# EAGLE design gesture_control_robot_tx (EAGLE 6.1)
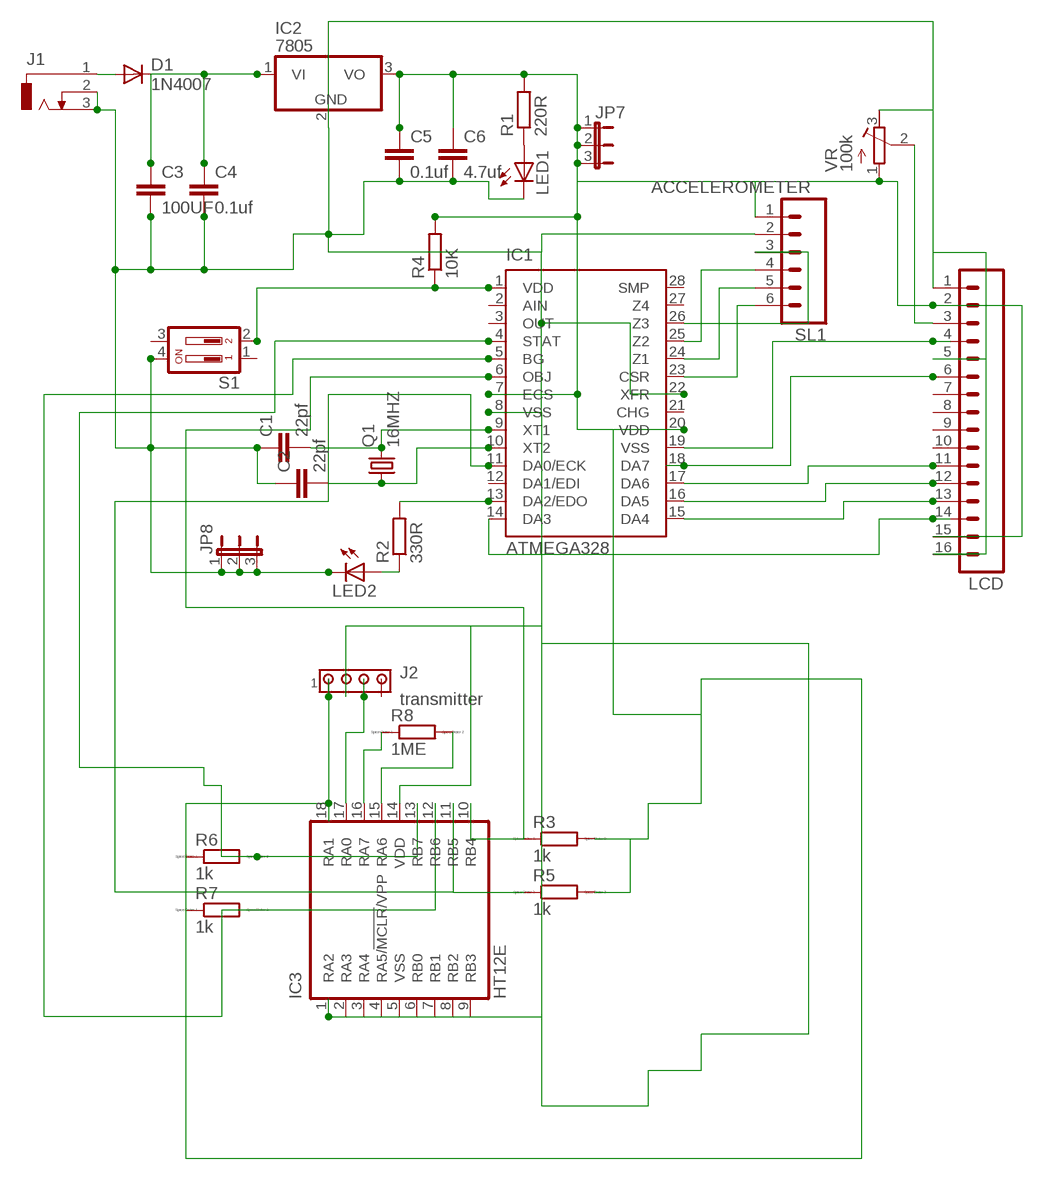
[diagram p0: schematic, sheet 1]

## Parts
C1  22pf  C2.5/2  [C2.5-2]
C2  22pf  C2.5/2  [C2.5-2]
C3  100UF  C2.5/2  [C2.5-2]
C4  0.1uf  C2.5/2  [C2.5-2]
C5  0.1uf  C2.5/2  [C2.5-2]
C6  4.7uf  C2.5/2  [C2.5-2]
D1  1N4007  1N4004  [DO41-10]
IC1  ATMEGA328  QT9701BD  [DIL28-3]
IC2  7805  786TV  [TO220V]
IC3  HT12E  PIC16F1826/27P  [DIL18]
J1  DCJ0303  [DCJ0303]
J2  transmitter  MTA04-100  [10X04MTA]
JP7  JP2E  [JP2]
JP8  JP2E  [JP2]
LCD  M16  [16P]
LED1  LED3MM  [LED3MM]
LED2  LED3MM  [LED3MM]
Q1  16MHZ  CRYSTALHC49S  [HC49/S]
R1  220R  R-EU_0207/10  [0207/10]
R2  330R  R-EU_0207/10  [0207/10]
R3  1k  R0204/7  [0204/7]
R4  10K  R-EU_0207/10  [0207/10]
R5  1k  R0204/7  [0204/7]
R6  1k  R0204/7  [0204/7]
R7  1k  R0204/7  [0204/7]
R8  1ME  R0204/7  [0204/7]
S1  DP02  [DP-02]
SL1  ACCELEROMETER  M06  [06P]
VR  100k  R-TRIMM64P  [RTRIM64P]

## Nets
N$1: C1.2 IC1.9(XT1) Q1.2
N$2: C2.2 IC1.10(XT2) Q1.1
N$3: D1.A J1.1
N$4: C5.1 C6.1 IC1.7(ECS) IC1.20(VDD) IC2.3(VO) IC3.18(RA1) J2.1 JP7.1 JP7.2 JP7.3 LCD.2 LCD.15 R1.2 R3.2 R4.2 R5.2 R6.1 R7.1 SL1.1 VR.1(E)
N$5: C1.1 C2.1 C3.2 C4.2 C5.2 C6.2 IC1.8(VSS) IC1.22(XFR) IC2.2(GND) IC3.1(RA2) IC3.2(RA3) IC3.3(RA4) IC3.4(RA5/!MCLR!/VPP) IC3.5(VSS) IC3.6(RB0) IC3.7(RB1) IC3.8(RB2) IC3.9(RB3) IC3.14(VDD) J1.2 J1.3 J2.2 JP8.1 JP8.2 JP8.3 LCD.1 LCD.5 LCD.16 LED1.K(C) LED2.K(C) S1.4 SL1.2 VR.3(A)
N$6: LED1.A R1.1
N$7: C3.1 C4.1 D1.C IC2.1(VI)
N$8: IC1.23(CSR) SL1.6
N$9: IC1.24(Z1) SL1.5
N$10: IC1.25(Z2) SL1.4
N$11: IC1.26(Z3) SL1.3
N$21: IC1.13(DA2/EDO) R2.2
N$22: LCD.3 VR.2(S)
N$23: IC1.19(VSS) LCD.4
N$24: IC1.18(DA7) LCD.6
N$25: IC1.17(DA6) LCD.11
N$26: IC1.16(DA5) LCD.12
N$27: IC1.15(DA4) LCD.13
N$29: IC1.14(DA3) LCD.14
N$30: IC1.6(OBJ) IC3.10(RB4) R3.1
N$31: IC1.1(VDD) R4.1 S1.2
N$32: LED2.A R2.1
N$33: IC1.11(DA0/ECK) IC3.11(RB5) R5.1
N$34: IC1.5(BG) IC3.12(RB6) R7.2
N$35: IC1.4(STAT) IC3.13(RB7) R6.2
N$36: IC3.16(RA7) R8.1
N$37: IC3.15(RA6) R8.2
N$38: IC3.17(RA0) J2.3
Unconnected: IC1.2(AIN) IC1.3(OUT) IC1.12(DA1/EDI) IC1.21(CHG) IC1.27(Z4) IC1.28(SMP) J2.4 LCD.7 LCD.8 LCD.9 LCD.10 S1.1 S1.3

## Library data of the parts
C1-C6 = capacitor-wima:C: CAPACITOR naming: grid - package width
D1 = diode:1N4004: DIODE general purpose rectifier, 1 A
IC1 = quantum-research-group:QT9701B: Charge-Transfer Capacitance Sensor IC Source: http://data.qprox.com/downloads/datasheets/qt9701b.pdf; OC_FARNELL: unknown; OC_NEWARK: unknown
IC2 = linear:78*: Positive VOLTAGE REGULATOR Source: http://cache.national.com/ds/LM/LM78L05.pdf http://www.fairchildsemi.com/ds/LM/LM7805.pdf
IC3 = microchip:PIC16*F1826/27: 18/20/28-Pin Flash Microcontrollers with nanoWatt XLP Technology Source: www.microchip.com PIC16F1827.pdf
J1 = con-jack:DCJ0303: DC POWER JACK Source: DCJ0303.pdf; OC_FARNELL: unknown; OC_NEWARK: unknown
J2 = con-amp:MTA04-100: AMP connector
JP7 JP8 = jumper:JP2E: JUMPER
LCD = con-amp-quick:M16: AMP QUICK CONNECTOR; OC_FARNELL: unknown; OC_NEWARK: unknown
LED1 LED2 = led:LED: LED OSRAM: - CHIPLED LG R971, LG N971, LY N971, LG Q971, LY Q971, LO R971, LY R971 LH N974, LH R974 LS Q976, LO Q976, LY Q976 LO Q996 - Hyper CHIPLED LW Q18S LB Q993, LB Q99A, LB R99A - SideLED LS A670, LO A670, LY A670, LG A670, LP A670 LB A673, LV A673, LT A673, LW A673 LH A674 LY A675 LS A676, LA A676, LO A676, LY A676, LW A676 LS A679, LY A679, LG A679 - Hyper Micro SIDELED® LS Y876, LA Y876, LO Y876, LY Y876 LT Y87S - SmartLED LW L88C, LW L88S LB L89C, LB L89S, LG L890 LS L89K, LO L89K, LY L89K LS L896, LA L896, LO L896, LY L896 - TOPLED LS T670, LO T670, LY T670, LG T670, LP T670 LSG T670, LSP T670, LSY T670, LOP T670, LYG T670 LG T671, LOG T671, LSG T671 LB T673, LV T673, LT T673, LW T673 LH T674 LS T676, LA T676, LO T676, LY T676, LB T676, LH T676, LSB T676, LW T676 LB T67C, LV T67C, LT T67C, LS T67K, LO T67K, LY T67K, LW E67C LS E67B, LA E67B, LO E67B, LY E67B, LB E67C, LV E67C, LT E67C LW T67C LS T679, LY T679, LG T679 LS T770, LO T770, LY T770, LG T770, LP T770 LB T773, LV T773, LT T773, LW T773 LH T774 LS E675, LA E675, LY E675, LS T675 LS T776, LA T776, LO T776, LY T776, LB T776 LHGB T686 LT T68C, LB T68C - Hyper Mini TOPLED® LB M676 - Mini TOPLED Santana® LG M470 LS M47K, LO M47K, LY M47K Source: http://www.osram.convergy.de LUXEON: - LUMILED® LXK2-PW12-R00, LXK2-PW12-S00, LXK2-PW14-U00, LXK2-PW14-V00 LXK2-PM12-R00, LXK2-PM12-S00, LXK2-PM14-U00 LXK2-PE12-Q00, LXK2-PE12-R00, LXK2-PE12-S00, LXK2-PE14-T00, LXK2-PE14-U00 LXK2-PB12-K00, LXK2-PB12-L00, LXK2-PB12-M00, LXK2-PB14-N00, LXK2-PB14-P00, LXK2-PB14-Q00 LXK2-PR12-L00, LXK2-PR12-M00, LXK2-PR14-Q00, LXK2-PR14-R00 LXK2-PD12-Q00, LXK2-PD12-R00, LXK2-PD12-S00 LXK2-PH12-R00, LXK2-PH12-S00 LXK2-PL12-P00, LXK2-PL12-Q00, LXK2-PL12-R00 Source: www.luxeon.com KINGBRIGHT: KA-3528ASYC Source: www.kingbright.com
Q1 = crystal:CRYSTAL: CRYSTAL; OC_FARNELL: 1667008; OC_NEWARK: unknown
R1 R2 R4 = rcl:R-EU_: RESISTOR, European symbol
R3 R5-R8 = eagle-ltspice:R: RESISTOR, European symbol; SPICEMODEL: NONE; SPICEPREFIX: R
S1 = switch-dil:DP02: DIL/CODE SWITCH; MPN: MCDP02; OC_FARNELL: 1255233; OC_NEWARK: 26M1095
SL1 = con-amp-quick:M06: AMP QUICK CONNECTOR; OC_FARNELL: unknown; OC_NEWARK: unknown
VR = resistor:R-TRIMM: Trimm resistor

## Board
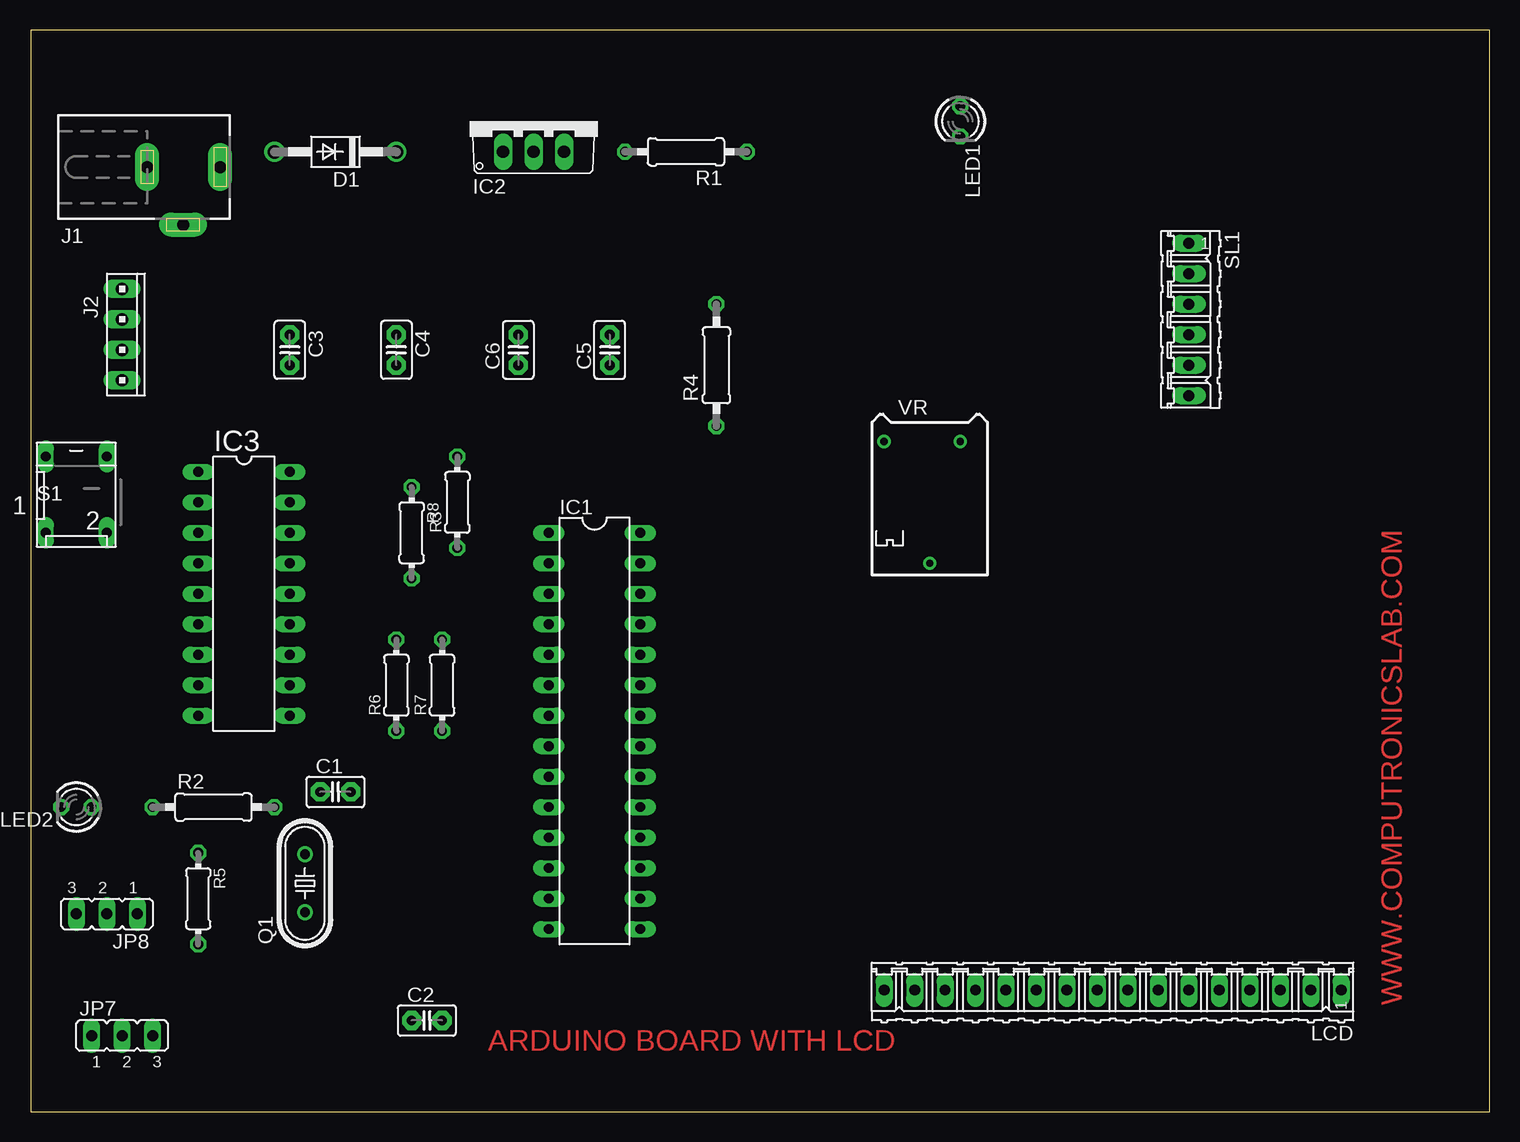
[diagram p1: board, top side]
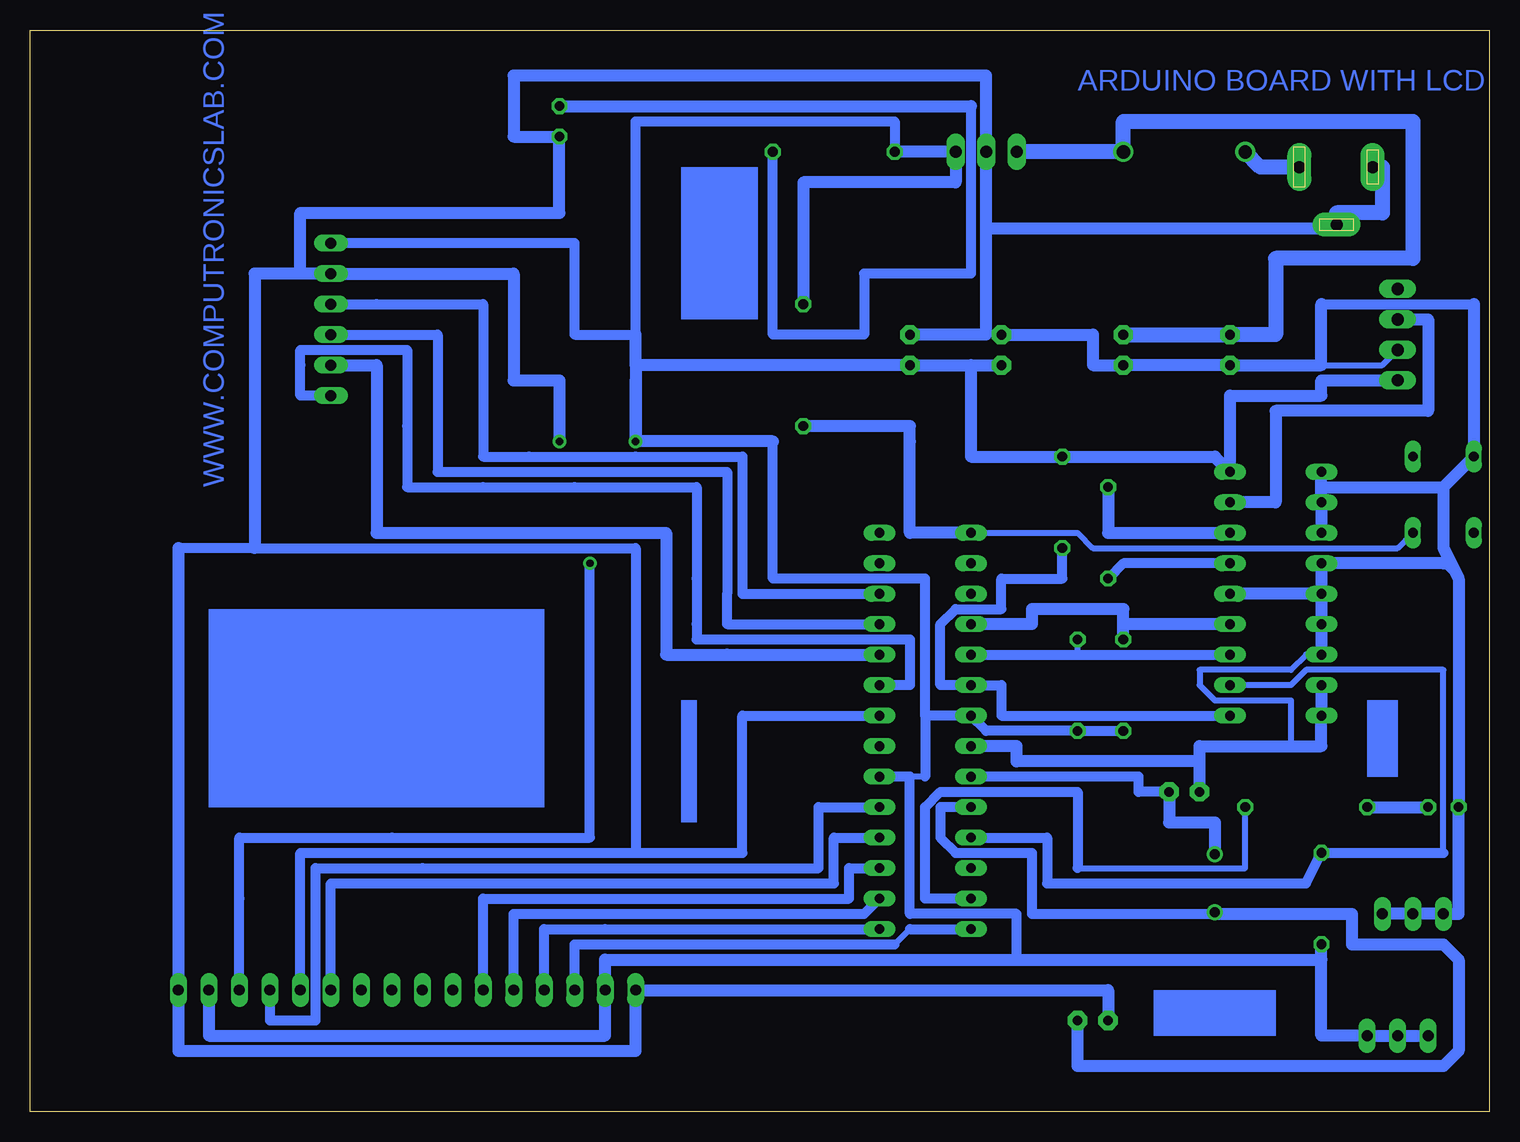
[diagram p2: board, bottom side, seen from below]

Size 121.59 x 90.16 mm. Coordinates in mm from the lower left corner, seen from the top.
Outline: 0,0 121.59,0 121.59,90.16 0,90.16 0,0
Copper layers (1*16): Top 0.035mm / dielectric 1.5mm / Bottom 0.035mm
Design rules: minimum track width 20mil, minimum drill 24mil, track to track 8mil, track to pad 8mil, pad to pad 8mil, via to via 8mil, smd to smd 8mil, copper to edge 40mil, drill to drill 8mil, minimum pad ring 10mil, minimum via ring 8mil, stop-mask expansion 4mil, vias tented up to drill 0mil, thermal gap 10mil

### Footprints (pad centres in the part's own frame; a part is rotated, then mirrored left to right if it is on the bottom)
C2.5-2 = drill 0.813 pad 1.6 octagon: 1 -1.27,0; 2 1.27,0
DO41-10 = drill 1.118: A 5.08,0; C -5.08,0
DIL28-3 = drill 0.813 long: 1 -16.51,-3.81; 2 -13.97,-3.81; 3 -11.43,-3.81; 4 -8.89,-3.81; 5 -6.35,-3.81; 6 -3.81,-3.81; 7 -1.27,-3.81; 8 1.27,-3.81; 9 3.81,-3.81; 10 6.35,-3.81; 11 8.89,-3.81; 12 11.43,-3.81; 13 13.97,-3.81; 14 16.51,-3.81; 15 16.51,3.81; 16 13.97,3.81; 17 11.43,3.81; 18 8.89,3.81; 19 6.35,3.81; 20 3.81,3.81; 21 1.27,3.81; 22 -1.27,3.81; 23 -3.81,3.81; 24 -6.35,3.81; 25 -8.89,3.81; 26 -11.43,3.81; 27 -13.97,3.81; 28 -16.51,3.81
TO220V = drill 1.016 long: 1 -2.54,-2.54; 2 0,-2.54; 3 2.54,-2.54
DIL18 = drill 0.813 long: 1 -10.16,-3.81; 2 -7.62,-3.81; 3 -5.08,-3.81; 4 -2.54,-3.81; 5 0,-3.81; 6 2.54,-3.81; 7 5.08,-3.81; 8 7.62,-3.81; 9 10.16,-3.81; 10 10.16,3.81; 11 7.62,3.81; 12 5.08,3.81; 13 2.54,3.81; 14 0,3.81; 15 -2.54,3.81; 16 -5.08,3.81; 17 -7.62,3.81; 18 -10.16,3.81
DCJ0303 = drill 1 pad 2 long: 1 0,3.1; 2 4.8,0; 3 0,-3
10X04MTA = drill 1.016 long: 1 3.81,0; 2 1.27,0; 3 -1.27,0; 4 -3.81,0
JP2 = drill 0.914 long: 1 -2.54,0; 2 0,0; 3 2.54,0
16P = drill 0.914 long: 1 -19.05,0; 2 -16.51,0; 3 -13.97,0; 4 -11.43,0; 5 -8.89,0; 6 -6.35,0; 7 -3.81,0; 8 -1.27,0; 9 1.27,0; 10 3.81,0; 11 6.35,0; 12 8.89,0; 13 11.43,0; 14 13.97,0; 15 16.51,0; 16 19.05,0
LED3MM = drill 0.813 octagon: A -1.27,0; K 1.27,0
HC49/S = drill 0.813: 1 -2.413,0; 2 2.413,0
0207/10 = drill 0.813 octagon: 1 -5.08,0; 2 5.08,0
0204/7 = drill 0.813 octagon: 1 -3.81,0; 2 3.81,0
DP-02 = drill 0.813 long: 1 -2.54,-2.54; 2 2.54,-2.54; 3 2.54,3.81; 4 -2.54,3.81
06P = drill 0.914 long: 1 -6.35,0; 2 -3.81,0; 3 -1.27,0; 4 1.27,0; 5 3.81,0; 6 6.35,0
RTRIM64P = drill 0.61: 1 -2.54,-3.81; 2 7.62,0; 3 -2.54,2.54

### Placement (x,y rotation side)
C1  25.4,26.67 0 top
C2  33.02,7.62 0 top
C3  21.59,63.5 270 top
C4  30.48,63.5 270 top
C5  48.26,63.5 90 top
C6  40.64,63.5 90 top
D1  25.4,80.01 180 top
IC1  46.99,31.75 270 top
IC2  41.91,82.55 0 top
IC3  17.78,43.18 270 top
J1  12.7,78.74 270 top
J2  7.62,64.77 270 top
JP7  7.62,6.35 0 top
JP8  6.35,16.51 180 top
LCD  90.17,10.16 180 top
LED1  77.47,82.55 270 top
LED2  3.81,25.4 180 top
Q1  22.86,19.05 90 top
R1  54.61,80.01 180 top
R2  15.24,25.4 0 top
R3  35.56,50.8 90 top
R4  57.15,62.23 90 top
R5  13.97,17.78 270 top
R6  30.48,35.56 90 top
R7  34.29,35.56 90 top
R8  31.75,48.26 270 top
S1  3.81,50.8 0 top
SL1  96.52,66.04 270 top
VR  74.93,53.34 270 top

### Tracks (layer width: path | path; a pad name or v marks a point on that pad's centre or on a via)
N$1
  Bottom 0.813: C1.2 29.21,26.67 29.21,27.94 IC1.9
  Bottom 1.016: Q1.2 22.86,24.13 26.67,24.13 C1.2
N$2
  Bottom 0.508: 22.86,16.51 Q1.1
  Bottom 0.813: 22.86,16.51 38.1,16.51 38.1,21.59 41.91,21.59 44.45,21.59 45.72,22.86 45.72,25.4 IC1.10
  Bottom 1.016: C2.2 34.29,3.81 3.81,3.81 2.54,5.08 2.54,12.7 3.81,13.97 11.43,13.97 11.43,16.51 22.86,16.51
N$3
  Bottom 1.27: D1.A 19.05,78.74 J1.1
N$4
  Bottom 0.508: 46.99,27.94 IC1.20
  Bottom 0.813: SL1.1 76.2,72.39 76.2,64.77 71.12,64.77 71.12,82.55 49.53,82.55 R1.2 | R6.1 R7.1 41.91,31.75 IC1.7 46.99,33.02 | 46.99,33.02 46.99,27.94 | IC1.20 48.26,27.94 48.26,16.51 39.37,16.51 39.37,12.7 | 59.69,55.88 59.69,44.45 46.99,44.45 46.99,33.02
  Bottom 1.016: J2.1 13.97,60.96 13.97,59.69 21.59,59.69 IC3.18 22.86,54.61 R3.2 43.18,54.61 43.18,62.23 | R1.2 IC2.3 44.45,77.47 57.15,77.47 R4.2 | 71.12,62.23 VR.1 | 71.12,62.23 C5.1 43.18,62.23 | VR.1 71.12,60.96 | 71.12,62.23 71.12,64.77 | 43.18,62.23 C6.1 | JP7.1 JP7.2 JP7.3 13.97,6.35 R5.2 13.97,12.7 39.37,12.7 73.66,12.7 LCD.15 73.66,6.35 106.68,6.35 LCD.2 | 59.69,55.88 VR.1
N$5
  Bottom 0.508: C1.1 24.13,29.21 | 2.54,44.45 3.81,45.72 | 16.51,30.48 16.51,34.29 22.86,34.29 24.13,35.56 24.13,36.83 16.51,36.83 15.24,38.1 IC3.7 | J2.2 8.89,62.23 13.97,62.23 | C6.2 41.91,64.77 | 12.7,73.66 J1.2
  Bottom 0.813: IC1.22 62.23,33.02 62.23,21.59 71.12,21.59 | 71.12,21.59 99.06,21.59 LCD.5 | 71.12,21.59 71.12,46.99 102.87,46.99 109.22,46.99 | 13.97,67.31 1.27,67.31
  Bottom 1.016: C2.1 31.75,10.16 LCD.16 71.12,5.08 109.22,5.08 LCD.1 109.22,46.99 | IC3.8 IC3.9 13.97,30.48 16.51,30.48 24.13,30.48 C1.1 | IC1.8 39.37,30.48 39.37,29.21 24.13,29.21 | JP8.1 JP8.2 JP8.3 2.54,16.51 LED2.K 2.54,44.45 3.81,46.99 3.81,52.07 | IC3.7 IC3.6 IC3.5 | IC3.5 IC3.4 3.81,45.72 | IC3.5 IC3.14 | IC3.3 IC3.2 13.97,52.07 | 13.97,52.07 IC3.1 | 3.81,52.07 S1.4 1.27,67.31 | 13.97,52.07 3.81,52.07 | VR.3 77.47,60.96 81.28,60.96 81.28,69.85 SL1.2 99.06,69.85 | 99.06,69.85 99.06,74.93 77.47,74.93 LED1.K 81.28,81.28 81.28,86.36 41.91,86.36 IC2.2 41.91,73.66 | 41.91,73.66 41.91,64.77 C5.2 | 41.91,73.66 12.7,73.66 | C6.2 33.02,64.77 33.02,62.23 C4.2 C3.2 13.97,62.23 13.97,67.31 | 102.87,46.99 102.87,69.85 99.06,69.85
  Bottom 1.27: J1.2 12.7,74.93 8.89,74.93 8.89,78.74 J1.3
N$6
  Bottom 0.813: R1.1 59.69,64.77 52.07,64.77 52.07,69.85 43.18,69.85 43.18,83.82
  Bottom 1.016: LED1.A 43.18,83.82
N$7
  Bottom 1.27: C4.1 C3.1 17.78,64.77 17.78,71.12 6.35,71.12 6.35,82.55 30.48,82.55 D1.C IC2.1
N$8
  Bottom 0.813: IC1.23 48.26,35.56 48.26,38.1 48.26,39.37 63.5,39.37 66.04,39.37 66.04,40.64 66.04,44.45 66.04,52.07 76.2,52.07 83.82,52.07 90.17,52.07 90.17,57.15 90.17,63.5 95.25,63.5 97.79,63.5 99.06,63.5 99.06,62.23 99.06,59.69 SL1.6
N$9
  Bottom 1.016: IC1.24 63.5,38.1 68.58,38.1 68.58,48.26 73.66,48.26 82.55,48.26 92.71,48.26 92.71,62.23 SL1.5
N$10
  Bottom 0.813: IC1.25 63.5,40.64 63.5,43.18 63.5,53.34 87.63,53.34 87.63,64.77 SL1.4
N$11
  Bottom 0.813: IC1.26 59.69,43.18 62.23,43.18 62.23,45.72 62.23,54.61 71.12,54.61 80.01,54.61 83.82,54.61 83.82,67.31 92.71,67.31 SL1.3
N$21
  Bottom 0.508: R2.2 20.32,20.32 34.29,20.32
  Bottom 0.813: 34.29,20.32 34.29,26.67 45.72,26.67 46.99,25.4 46.99,17.78 IC1.13
N$22
  Bottom 0.813: VR.2 74.93,22.86 91.44,22.86 104.14,22.86 104.14,17.78 LCD.3
N$23
  Bottom 0.813: IC1.19 55.88,25.4 55.88,20.32 88.9,20.32 97.79,20.32 97.79,17.78 97.79,11.43 97.79,7.62 99.06,7.62 101.6,7.62 LCD.4
N$24
  Bottom 0.813: IC1.18 54.61,22.86 54.61,19.05 96.52,19.05 LCD.6
N$25
  Bottom 0.813: IC1.17 53.34,20.32 53.34,17.78 83.82,17.78 LCD.11
N$26
  Bottom 0.813: IC1.16 52.07,16.51 74.93,16.51 81.28,16.51 81.28,15.24 LCD.12
N$27
  Bottom 0.813: IC1.15 73.66,15.24 78.74,15.24 78.74,13.97 LCD.13
N$29
  Bottom 0.508: 49.53,13.97 48.26,15.24
  Bottom 0.813: 48.26,15.24 IC1.14 | 49.53,13.97 72.39,13.97 76.2,13.97 76.2,12.7 LCD.14
N$30
  Bottom 0.813: IC3.10 40.64,33.02 40.64,35.56 IC1.6 45.72,35.56 45.72,40.64 44.45,41.91 40.64,41.91 40.64,44.45 35.56,44.45 R3.1
N$31
  Bottom 0.508: S1.2 7.62,46.99 33.02,46.99 34.29,48.26 IC1.1
  Bottom 1.016: R4.1 48.26,57.15 48.26,55.88 48.26,48.26 IC1.1
N$32
  Bottom 1.016: R2.1 LED2.A
N$33
  Bottom 0.508: IC3.11 16.51,35.56 15.24,36.83 3.81,36.83 3.81,21.59
  Bottom 0.813: IC1.11 36.83,22.86 36.83,19.05 15.24,19.05 R5.1 3.81,21.59
N$34
  Bottom 0.508: 34.29,38.1 R7.2
  Bottom 0.813: IC1.5 34.29,38.1 IC3.12
N$35
  Bottom 1.016: R6.2 30.48,40.64 | IC3.13 30.48,40.64 | 30.48,40.64 30.48,41.91 38.1,41.91 38.1,40.64 IC1.4
N$36
  Bottom 1.016: IC3.16 31.75,48.26 R8.1
N$37
  Bottom 0.813: R8.2 30.48,45.72 IC3.15
N$38
  Bottom 1.016: IC3.17 17.78,50.8 17.78,58.42 5.08,58.42 5.08,66.04 J2.3
(copper drawn outside any net)
  shapes: Bottom area x5

### Text on the board
Top: WWW.COMPUTRONICSLAB.COM | ARDUINO BOARD WITH LCD
Bottom: ARDUINO BOARD WITH LCD | WWW.COMPUTRONICSLAB.COM